# EAGLE schematic ARC Shield 0.1 (EAGLE 6.5.0)
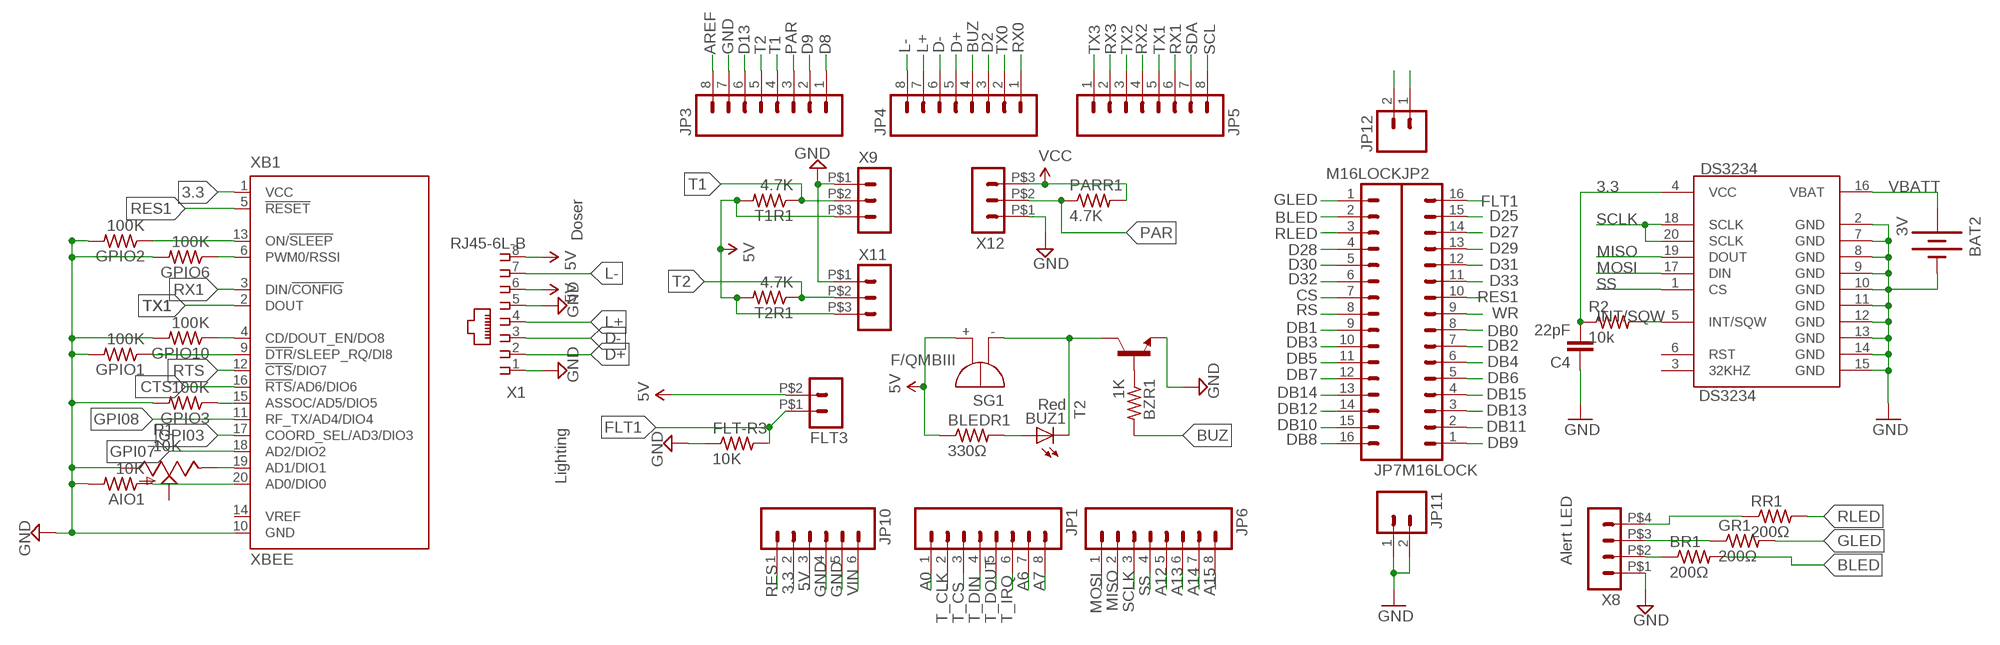
[diagram p0: schematic, sheet 1]

## Parts
AIO1  10K  R-US_0204/7  [0204/7]
BAT2  3V  BATTERY  [BATTCON_12MM_CURVED]
BLEDR1  330Ω  R-US_0204/7  [0204/7]
BR1  200Ω  R-US_0204/7  [0204/7]
BUZ1  Red  LED3MM  [LED3MM]
BZR1  1K  R-US_0204/7  [0204/7]
C4  22pF  C5/3  [C5B3]
DS3234  DS3234  [DS3234]
FLT3  HEADER_POS2_43045-0200  [43045-0200]
FLT-R3  10K  R-US_0204/7  [0204/7]
GPIO1  100K  R-US_0204/7  [0204/7]
GPIO2  100K  R-US_0204/7  [0204/7]
GPIO3  100K  R-US_0204/7  [0204/7]
GPIO6  100K  R-US_0204/7  [0204/7]
GPIO10  100K  R-US_0204/7  [0204/7]
GR1  200Ω  R-US_0204/7  [0204/7]
JP1  M08LOCK  [1X08_LOCK]
JP2  M16LOCK  [1X16_LOCK]
JP3  M08LOCK  [1X08_LOCK]
JP4  M08LOCK  [1X08_LOCK]
JP5  M08LOCK  [1X08_LOCK]
JP6  M08LOCK  [1X08_LOCK]
JP7  M16LOCK  [1X16_LOCK]
JP10  M06LOCK  [1X06_LOCK]
JP11  M02LOCK  [1X02_LOCK]
JP12  M02LOCK  [1X02_LOCK]
PARR1  4.7K  R-US_0204/7  [0204/7]
R1  10K  TRIM_US-B25U  [B25U]
R2  10k  R-US_0204/7  [0204/7]
RR1  200Ω  R-US_0204/7  [0204/7]
SG1  F/QMBIII  [F/QMBIII]
T1R1  4.7K  R-US_0204/7  [0204/7]
T2  -NPN-TO92  [TO92]
T2R1  4.7K  R-US_0204/7  [0204/7]
X1  RJ45-6L-B  [RJ45-NO-SHIELD]
X8  HEADER_POS4_43045-0401  [43045-0400]
X9  HEADER_POS3_43650-0300  [43650-0300]
X11  HEADER_POS3_43650-0300  [43650-0300]
X12  HEADER_POS3_43650-0300  [43650-0300]
XB1  XBEE  [XBEE]

## Nets
3.3 [1A]: C4.2 DS3234.4(VCC) JP10.2 R2.1 XB1.1(VCC)
5V [1A]: BLEDR1.1 FLT3.P$2 JP10.3 PARR1.2 SG1.+(-) T1R1.2 T2R1.2 X1.6 X1.8 X9.P$3 X11.P$3 X12.P$3 ; supply symbol labelled VCC
5V@1 [1A]: JP12.1 JP12.2
A0: JP1.1
A6: JP1.7
A7: JP1.8
A12: JP6.5
A13: JP6.6
A14: JP6.7
A15: JP6.8
AREF: JP3.8
BLED: BR1.2 JP7.2
BUZ: BZR1.2 JP4.4
CS: JP7.7
CTS: XB1.16(!RTS!/AD6/DIO6)
D2: JP4.3
D8: JP3.1
D9: JP3.2
D13: JP3.6
D25: JP2.15
D27: JP2.14
D28: JP7.4
D29: JP2.13
D30: JP7.5
D31: JP2.12
D32: JP7.6
D33: JP2.11
D+: JP4.5 X1.2
D-: JP4.6 X1.3
DB0: JP2.8
DB1: JP7.9
DB2: JP2.7
DB3: JP7.10
DB4: JP2.6
DB5: JP7.11
DB6: JP2.5
DB7: JP7.12
DB8: JP7.16
DB9: JP2.1
DB10: JP7.15
DB11: JP2.2
DB12: JP7.14
DB13: JP2.3
DB14: JP7.13
DB15: JP2.4
FLT1 [1A]: FLT3.P$1 FLT-R3.2 JP2.16
GLED: GR1.2 JP7.1
GND [1A]: AIO1.2 BAT2.GND(-) C4.1 DS3234.2(GND) DS3234.7(GND) DS3234.8(GND) DS3234.9(GND) DS3234.10(GND) DS3234.11(GND) DS3234.12(GND) DS3234.13(GND) DS3234.14(GND) DS3234.15(GND) FLT-R3.1 GPIO1.2 GPIO2.2 GPIO3.2 GPIO6.2 GPIO10.2 JP3.7 JP10.4 JP10.5 JP11.1 JP11.2 R1.A T2.1(E) X1.1 X1.5 X8.P$1 X9.P$1 X11.P$1 X12.P$1 XB1.10(GND)
GPI03: XB1.17(COORD_SEL/AD3/DIO3)
GPI07: XB1.18(AD2/DIO2)
GPI08: XB1.11(RF_TX/AD4/DIO4)
INT/SQW [1A]: DS3234.5(INT/SQW) R2.2
L+: JP4.7 X1.4
L-: JP4.8 X1.7
MISO: DS3234.19(DOUT) JP6.2
MOSI: DS3234.17(DIN) JP6.1
N$1: BR1.1 X8.P$2
N$2 [1A]: BUZ1.K(C) SG1.-(+) T2.3(C)
N$3: BZR1.1 T2.2(B)
N$4 [1A]: R1.E XB1.19(AD1/DIO1)
N$5: GR1.1 X8.P$3
N$7: RR1.1 X8.P$4
N$14 [1A]: GPIO10.1 XB1.4(CD/DOUT_EN/DO8)
N$15 [1A]: GPIO2.1 XB1.13(ON/!SLEEP)
N$16 [1A]: GPIO6.1 XB1.6(PWM0/RSSI)
N$17 [1A]: GPIO1.1 XB1.9(!DTR!/SLEEP_RQ/DI8)
N$18 [1A]: GPIO3.1 XB1.15(ASSOC/AD5/DIO5)
N$19 [1A]: BLEDR1.2 BUZ1.A
N$20 [1A]: AIO1.1 XB1.20(AD0/DIO0)
PAR [1A]: JP3.3 PARR1.1 X12.P$2
RES: JP10.1
RES1: JP2.10 XB1.5(!RESET)
RLED: JP7.3 RR1.2
RS: JP7.8
RTS: XB1.12(!CTS!/DIO7)
RX0: JP4.1
RX1: JP5.6 XB1.3(DIN/!CONFIG)
RX2: JP5.4
RX3: JP5.2
SCL: JP5.8
SCLK: DS3234.18(SCLK) DS3234.20(SCLK) JP6.3
SDA: JP5.7
SS: DS3234.1(CS) JP6.4
T1 [1A]: JP3.4 T1R1.1 X9.P$2
T2 [1A]: JP3.5 T2R1.1 X11.P$2
T_CLK: JP1.2
T_CS: JP1.3
T_DIN: JP1.4
T_DOUT: JP1.5
T_IRQ: JP1.6
TX0: JP4.2
TX1: JP5.5 XB1.2(DOUT)
TX2: JP5.3
TX3: JP5.1
VBATT [1A]: BAT2.PWR@1(+) DS3234.16(VBAT)
VIN: JP10.6
WR: JP2.9
Unconnected: DS3234.3(32KHZ) DS3234.6(RST) R1.S XB1.14(VREF)

## Notes on the sheet
- Doser
- Lighting
- Alert LED

## Library data of the parts
AIO1 BLEDR1 BR1 BZR1 FLT-R3 GPIO1-GPIO3 GPIO6 GPIO10 GR1 PARR1 R2 RR1 T1R1 T2R1 = rcl:R-US_: RESISTOR, American symbol
BAT2 = SparkFun:BATTERY: Battery Holders Various common sizes : AA, AAA, 20mm coin cell and 12mm coin cell.
BUZ1 = led:LED: LED OSRAM: - CHIPLED LG R971, LG N971, LY N971, LG Q971, LY Q971, LO R971, LY R971 LH N974, LH R974 LS Q976, LO Q976, LY Q976 LO Q996 - Hyper CHIPLED LW Q18S LB Q993, LB Q99A, LB R99A - SideLED LS A670, LO A670, LY A670, LG A670, LP A670 LB A673, LV A673, LT A673, LW A673 LH A674 LY A675 LS A676, LA A676, LO A676, LY A676, LW A676 LS A679, LY A679, LG A679 - Hyper Micro SIDELED® LS Y876, LA Y876, LO Y876, LY Y876 LT Y87S - SmartLED LW L88C, LW L88S LB L89C, LB L89S, LG L890 LS L89K, LO L89K, LY L89K LS L896, LA L896, LO L896, LY L896 - TOPLED LS T670, LO T670, LY T670, LG T670, LP T670 LSG T670, LSP T670, LSY T670, LOP T670, LYG T670 LG T671, LOG T671, LSG T671 LB T673, LV T673, LT T673, LW T673 LH T674 LS T676, LA T676, LO T676, LY T676, LB T676, LH T676, LSB T676, LW T676 LB T67C, LV T67C, LT T67C, LS T67K, LO T67K, LY T67K, LW E67C LS E67B, LA E67B, LO E67B, LY E67B, LB E67C, LV E67C, LT E67C LW T67C LS T679, LY T679, LG T679 LS T770, LO T770, LY T770, LG T770, LP T770 LB T773, LV T773, LT T773, LW T773 LH T774 LS E675, LA E675, LY E675, LS T675 LS T776, LA T776, LO T776, LY T776, LB T776 LHGB T686 LT T68C, LB T68C - Hyper Mini TOPLED® LB M676 - Mini TOPLED Santana® LG M470 LS M47K, LO M47K, LY M47K Source: http://www.osram.convergy.de LUXEON: - LUMILED® LXK2-PW12-R00, LXK2-PW12-S00, LXK2-PW14-U00, LXK2-PW14-V00 LXK2-PM12-R00, LXK2-PM12-S00, LXK2-PM14-U00 LXK2-PE12-Q00, LXK2-PE12-R00, LXK2-PE12-S00, LXK2-PE14-T00, LXK2-PE14-U00 LXK2-PB12-K00, LXK2-PB12-L00, LXK2-PB12-M00, LXK2-PB14-N00, LXK2-PB14-P00, LXK2-PB14-Q00 LXK2-PR12-L00, LXK2-PR12-M00, LXK2-PR14-Q00, LXK2-PR14-R00 LXK2-PD12-Q00, LXK2-PD12-R00, LXK2-PD12-S00 LXK2-PH12-R00, LXK2-PH12-S00 LXK2-PL12-P00, LXK2-PL12-Q00, LXK2-PL12-R00 Source: www.luxeon.com KINGBRIGHT: KA-3528ASYC Source: www.kingbright.com
C4 = capacitor-wima:C: CAPACITOR naming: grid - package width
DS3234 = SparkFun:DS3234: DS3234 Real Time Clock
FLT3 = con-molex-micro-fit-3_0:HEADER_POS2_?: Molex - Micro-Fit 3.0 Series connector, 3.00mm (0.118") pitch header, 2 positions.
JP1 JP3-JP6 = SparkFun:M08: Header 8 Standard 8-pin 0.1" header. Use with straight break away headers (SKU : PRT-00116), right angle break away headers (PRT-00553), swiss pins (PRT-00743), machine pins (PRT-00117), and female headers (PRT-00115).
JP2 JP7 = SparkFun:M16
JP10 = SparkFun:M06: Header 6 Standard 6-pin 0.1" header. Use with straight break away headers (SKU : PRT-00116), right angle break away headers (PRT-00553), swiss pins (PRT-00743), machine pins (PRT-00117), and female headers (PRT-00115). Molex polarized connector foot print use with SKU : PRT-08094 with associated crimp pins and housings. NOTES ON THE VARIANTS LOCK and LOCK_LONGPADS... This footprint was designed to help hold the alignment of a through-hole component (i.e. 6-pin header) while soldering it into place. You may notice that each hole has been shifted either up or down by 0.005 of an inch from it's more standard position (which is a perfectly straight line). This slight alteration caused the pins (the squares in the middle) to touch the edges of the holes. Because they are alternating, it causes a "brace" to hold the component in place. 0.005 has proven to be the perfect amount of "off-center" position when using our standard breakaway headers. Although looks a little odd when you look at the bare footprint, once you have a header in there, the alteration is very hard to notice. Also, if you push a header all the way into place, it is covered up entirely on the bottom side. This idea of altering the position of holes to aid alignment will be further integrated into the Sparkfun Library for other footprints. It can help hold any component with 3 or more connection pins.
JP11 JP12 = SparkFun:M02: Header 2 Standard 2-pin 0.1" header. Use with straight break away headers (SKU : PRT-00116), right angle break away headers (PRT-00553), swiss pins (PRT-00743), machine pins (PRT-00117), and female headers (PRT-00115). Molex polarized connector foot print use with SKU : PRT-08233 with associated crimp pins and housings.
R1 = pot:TRIM_US-: POTENTIOMETER
SG1 = buzzer:F/QMBIII: BUZZER Source: Buerklin; OC_FARNELL: unknown; OC_NEWARK: unknown
T2 = transistor:*-NPN-: NPN Transistror BF959 corrected 2008.03.06
X1 = con-tycoelectronics:RJ45: CORCOM Modular RJ Jacks No Shield Source: www.tycoelectronics.com .. ENG_DS_1654001_1099_RJ_L_0507.pdf; MPN: RJ45-6L-B; OC_FARNELL: unknown; OC_NEWARK: 16R6090
X8 = con-molex-micro-fit-3_0:HEADER_POS4_?: Molex - Micro-Fit 3.0 Series connector, 3.00mm (0.118") pitch header, 4 positions.
X9 X11 X12 = con-molex-micro-fit-3_0:HEADER_POS3_?: Molex - Micro-Fit 3.0 Series connector, 3.00mm (0.118") pitch header, 3 positions.
XB1 = maxstream:XBEE: XBee (TM) /XBee-PRO(TM) OEM RF Modules Source: MaxStream, Inc. xbee_productmanual.pdf; MPN: XBP24-Z7UIT-004; OC_FARNELL: 1751799; OC_NEWARK: 34R5507

## Net classes
0 default: width 0.406 mm, clearance 0.356 mm
2 1A: width 0.635 mm, clearance 0.356 mm